# EAGLE design GPS_radiologger_v21_L70_CMWX (EAGLE 9.6.2)
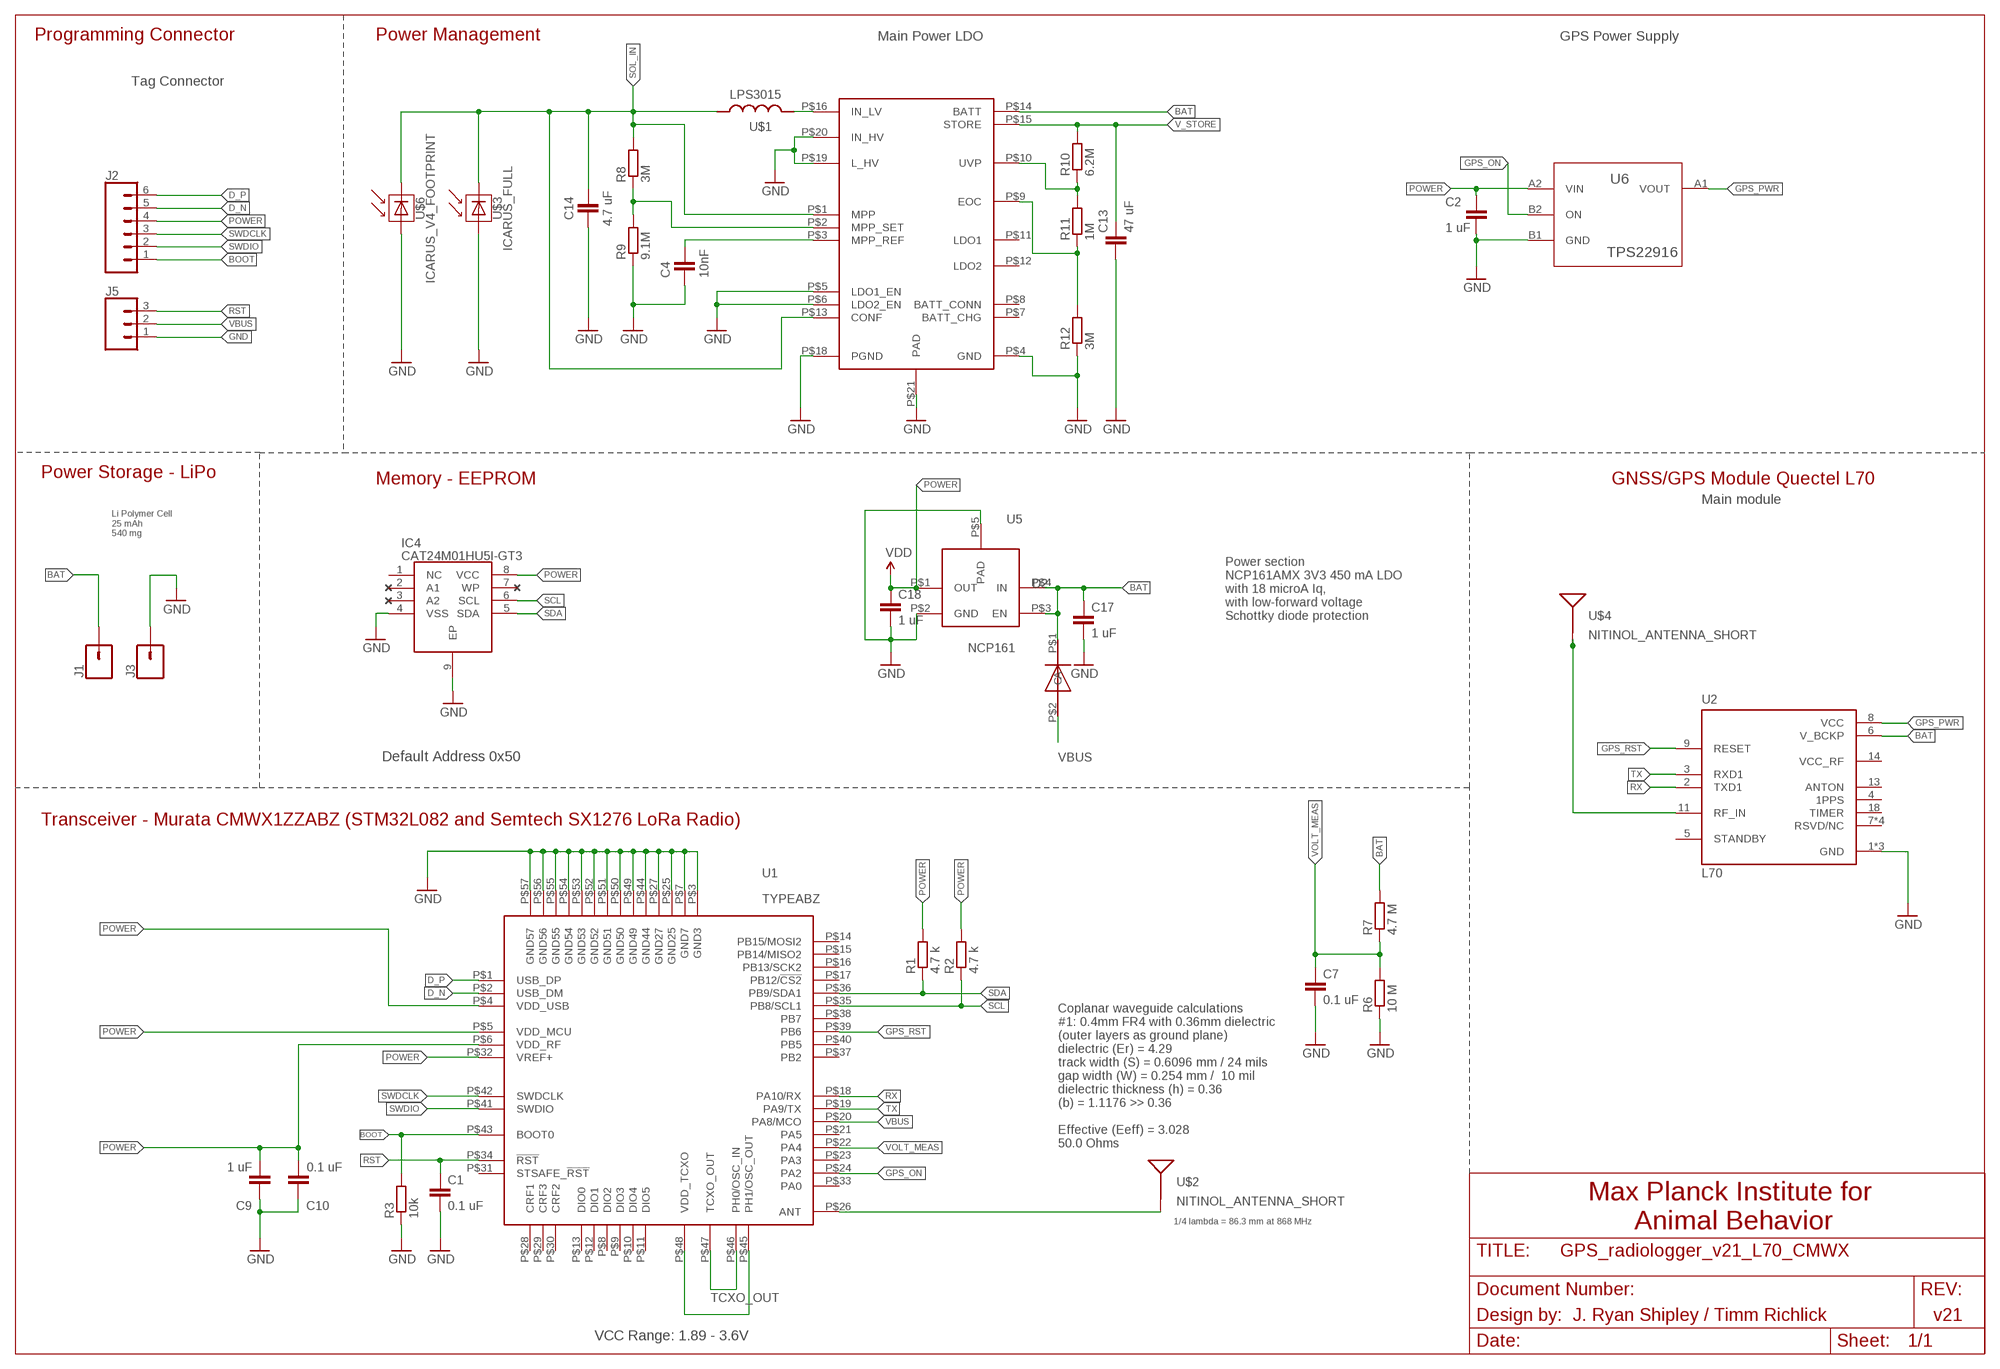
[diagram p0: schematic, sheet 1]

## Parts
C1  0.1 uF  C-EUC0201  [C0201]
C2  1 uF  C-EUC0201  [C0201]
C4  10nF  C-EUC0201  [C0201]
C7  0.1 uF  C-EUC0201  [C0201]
C9  1 uF  C-EUC0201  [C0201]
C10  0.1 uF  C-EUC0201  [C0201]
C13  47 uF  C-EUC0603  [C0603]
C14  4.7 uF  C-EUC0201  [C0201]
C17  1 uF  0402CAP.KW  [0402-CAP]
C18  1 uF  0402CAP.KW  [0402-CAP]
D2  CDSQR4148-HF  [CDSQR4148-HF]
IC4  CAT24M01HU5I-GT3  [SON50P300X200X55-9N]
J1  CONN_01PTH_NO_SILK_SMALL  [1X01_SMALL]
J2  CONN_061.27MM  [1X06_1.27MM]
J3  CONN_01PTH_NO_SILK_SMALL  [1X01_SMALL]
J5  CONN_031X03_1.27_NO_SILK  [1X03_1.27MM_NO_SILK]
R1  4.7 k  R-EU_R0201  [R0201]
R2  4.7 k  R-EU_R0201  [R0201]
R3  10k  R-EU_R0201  [R0201]
R6  10 M  R-EU_R0201  [R0201]
R7  4.7 M  R-EU_R0201  [R0201]
R8  3M  R-EU_R0201  [R0201]
R9  9.1M  R-EU_R0201  [R0201]
R10  6.2M  R-EU_R0201  [R0201]
R11  1M  R-EU_R0201  [R0201]
R12  3M  R-EU_R0201  [R0201]
U1  TYPEABZ  [TYPEABZ]
U2  L70  [XCVR_L70]
U4  SPV1050  [SPV1050]
U5  NCP161  [NCP161]
U6  TPS22916  [TPS22916]
U$1  LPS3015  [LPS_3015]
U$2  NITINOL_ANTENNA_SHORT  [ICARUS_NITINOL_ANTENNA_SHORT]
U$3  ICARUS_FULL  [ICARUS_FULL]
U$4  NITINOL_ANTENNA_SHORT  [ICARUS_NITINOL_ANTENNA_SHORT]
U$6  ICARUS_V4_FOOTPRINT  [ICARUS_FULL_FOOTPRINT]

## Nets
BAT [battery]: C17.1 D2.P$1(C) J1.P$1 R7.2 U2.6(V_BCKP) U4.P$14(BATT) U5.P$3(EN) U5.P$4(IN)
BOOT: J2.1 R3.2 U1.P$43(BOOT0)
D_N [diff_pair]: J2.5 U1.P$2(USB_DM)
D_P [diff_pair]: J2.6 U1.P$1(USB_DP)
GND: C1.2 C2.2 C4.2 C7.2 C9.1 C10.1 C13.2 C14.2 C17.2 C18.2 IC4.4(VSS) IC4.9(EP) J3.P$1 J5.1 R3.1 R6.1 R9.1 R12.1 U1.P$3(GND3) U1.P$7(GND7) U1.P$25(GND25) U1.P$27(GND27) U1.P$44(GND44) U1.P$49(GND49) U1.P$50(GND50) U1.P$51(GND51) U1.P$52(GND52) U1.P$53(GND53) U1.P$54(GND54) U1.P$55(GND55) U1.P$56(GND56) U1.P$57(GND57) U2.1(GND) U2.10(GND) U2.12(GND) U4.P$4(GND) U4.P$5(LDO1_EN) U4.P$6(LDO2_EN) U4.P$18(PGND) U4.P$19(L_HV) U4.P$20(IN_HV) U4.P$21(PAD) U5.P$2(GND) U5.P$5(PAD) U6.B1(GND) U$3.P$2(MINUS) U$6.P$3(MINUS)
GPS_ON: U1.P$24(PA2) U6.B2(ON)
GPS_PWR: U2.8(VCC) U6.A1(VOUT)
GPS_RST: U1.P$39(PB6) U2.9(RESET)
N$1: U1.P$45(PH1/OSC_OUT) U1.P$48(VDD_TCXO)
N$2 [antenna]: U2.11(RF_IN) U$4.1(SIGNAL) U$4.2(SIGNAL) U$4.3(SIGNAL)
N$4: U4.P$16(IN_LV) U$1.P$2
N$6: R8.1 R9.2 U4.P$2(MPP_SET)
N$8: R10.1 R11.2 U4.P$10(UVP)
N$9: R11.1 R12.2 U4.P$9(EOC)
N$11 [antenna]: U1.P$26(ANT) U$2.1(SIGNAL) U$2.2(SIGNAL) U$2.3(SIGNAL)
N$13: C4.1 U4.P$3(MPP_REF)
POWER [power]: C2.1 C9.2 C10.2 C18.1 IC4.8(VCC) J2.4 R1.2 R2.2 U1.P$4(VDD_USB) U1.P$5(VDD_MCU) U1.P$6(VDD_RF) U1.P$32(VREF+) U5.P$1(OUT) U6.A2(VIN) ; supply symbol labelled VDD
RST: C1.1 J5.3 U1.P$34(!RST)
RX: U1.P$18(PA10/RX) U2.2(TXD1)
SCL: IC4.6(SCL) R2.1 U1.P$35(PB8/SCL1)
SDA: IC4.5(SDA) R1.1 U1.P$36(PB9/SDA1)
SOL_IN [battery]: C14.1 R8.2 U4.P$1(MPP) U4.P$13(CONF) U$1.P$1 U$3.P$1(PLUS) U$6.P$1(PLUS)
SWDCLK: J2.3 U1.P$42(SWDCLK)
SWDIO: J2.2 U1.P$41(SWDIO)
TCXO_OUT: U1.P$46(PH0/OSC_IN) U1.P$47(TCXO_OUT)
TX: U1.P$19(PA9/TX) U2.3(RXD1)
V_STORE: C13.1 R10.2 U4.P$15(STORE)
VBUS: D2.P$2(A) J5.2 U1.P$20(PA8/MCO)
VOLT_MEAS: C7.1 R6.2 R7.1 U1.P$22(PA4)
Unconnected: IC4.1(NC) IC4.2(A1) IC4.3(A2) IC4.7(WP) U1.P$8(DIO2) U1.P$9(DIO3) U1.P$10(DIO4) U1.P$11(DIO5) U1.P$12(DIO1) U1.P$13(DIO0) U1.P$14(PB15/MOSI2) U1.P$15(PB14/MISO2) U1.P$16(PB13/SCK2) U1.P$17(PB12/!CS2) U1.P$21(PA5) U1.P$23(PA3) U1.P$28(CRF1) U1.P$29(CRF3) U1.P$30(CRF2) U1.P$31(STSAFE_!RST) U1.P$33(PA0) U1.P$37(PB2) U1.P$38(PB7) U1.P$40(PB5) U2.4(1PPS) U2.5(STANDBY) U2.7(RSVD/NC) U2.13(ANTON) U2.14(VCC_RF) U2.15(RSVD/NC) U2.16(RSVD/NC) U2.17(RSVD/NC) U2.18(TIMER) U4.P$7(BATT_CHG) U4.P$8(BATT_CONN) U4.P$11(LDO1) U4.P$12(LDO2)

## Notes on the sheet
- Programming Connector | Power Management | Main Power LDO | GPS Power Supply
- Tag Connector
- Power Storage - LiPo
- Memory - EEPROM | GNSS/GPS Module Quectel L70
- Main module
- Li Polymer Cell
  25 mAh
  540 mg
- Power section
  NCP161AMX 3V3 450 mA LDO
  with 18 microA Iq, 
  with low-forward voltage 
  Schottky diode protection
- Default Address 0x50
- Transceiver - Murata CMWX1ZZABZ (STM32L082 and Semtech SX1276 LoRa Radio)
- Coplanar waveguide calculations
  #1: 0.4mm FR4 with 0.36mm dielectric 
  (outer layers as ground plane)
  dielectric (Er) = 4.29
  track width (S) = 0.6096 mm / 24 mils
  gap width (W) = 0.254 mm /  10 mil
  dielectric thickness (h) = 0.36
  (b) = 1.1176 >> 0.36
  
  Effective (Eeff) = 3.028
  50.0 Ohms
- Max Planck Institute for 
  Animal Behavior
- 1/4 lambda = 86.3 mm at 868 MHz
- Design by: | J. Ryan Shipley / Timm Richlick | v21
- VCC Range: 1.89 - 3.6V

## Library data of the parts
C1 C2 C4 C7 C9 C10 C13 C14 = rcl:C-EU: CAPACITOR, European symbol; SPICEPREFIX: C
C17 C18 = SparkFun-Capacitors:0402CAP.KW
D2 = Kris:CDSQR4148-HF: ComChip's CDSQR4148-HF high speed 150 mA Io diode
IC4 = CAT24M01HU5I-GT3-CorrectedV2:CAT24M01HU5I-GT3: EEPROM 1MB I2C SERIAL EEPROM Source: Datasheet <http://www.onsemi.com/pub/Collateral/CAT24M01-D.PDF>; ALLIED_NUMBER: 70300250; ALLIED_PRICE-STOCK: http://www.alliedelec.com/on-semiconductor-cat24m01hu5i-gt3/70300250/; DESCRIPTION: EEPROM 1MB I2C SERIAL EEPROM; HEIGHT: 0.55mm; MANUFACTURER_NAME: ON Semiconductor; MANUFACTURER_PART_NUMBER: CAT24M01HU5I-GT3; MOUSER_PART_NUMBER: 863-CAT24M01HU5I-GT3; MOUSER_PRICE-STOCK: https://www.mouser.com/Search/Refine.aspx?Keyword=863-CAT24M01HU5I-GT3; RS_PART_NUMBER: 7814831P; RS_PRICE-STOCK: http://uk.rs-online.com/web/p/products/7814831P
J1 J3 = SparkFun-Connectors:CONN_01: Single connection point. Often used as Generic Header-pin footprint for 0.1 inch spaced/style header connections On any of the 0.1 inch spaced packages, you can populate with these: Break Away Headers - Straight <https://www.sparkfun.com/products/116> (PRT-00116) Break Away Male Headers - Right Angle <https://www.sparkfun.com/products/553> (PRT-00553) Female Headers <https://www.sparkfun.com/products/115> (PRT-00115) Break Away Headers - Machine Pin <https://www.sparkfun.com/products/117> (PRT-00117) Break Away Female Headers - Swiss Machine Pin <https://www.sparkfun.com/products/743> (PRT-00743) This device is also useful as a general connection point to wire up your design to another part of your project. Our various solder wires solder well into these plated through hole pads. Hook-Up Wire - Assortment (Stranded, 22 AWG) <https://www.sparkfun.com/products/11375> (PRT-11375) Hook-Up Wire - Assortment (Solid Core, 22 AWG) <https://www.sparkfun.com/products/11367> (PRT-11367) View the entire wire category on our website here <https://www.sparkfun.com/categories/141> Special notes: SMTSO-256-ET is a "flush mount" nut for a 4-40 screw. We mostly use this on specialty testbeds; it is a nice way to connect hardware to your PCB at an adjustable hieght. Also note, the SNAP packages are for using a snappable style connector. We sell a baggie of snaps and they are also used on two LilyPad designs: Snap Assortment - 30 pack (male and female) <https://www.sparkfun.com/products/11347> (DEV-11347) LilyPad Arduino SimpleSnap <https://www.sparkfun.com/products/10941> (DEV-10941) LilyPad SimpleSnap Protoboard <https://www.sparkfun.com/products/10940> (DEV-10940)
J2 = SparkFun-Connectors:CONN_06: Multi connection point. Often used as Generic Header-pin footprint for 0.1 inch spaced/style header connections On any of the 0.1 inch spaced packages, you can populate with these: Break Away Headers - Straight <https://www.sparkfun.com/products/116> (PRT-00116) Break Away Male Headers - Right Angle <https://www.sparkfun.com/products/553> (PRT-00553) Female Headers <https://www.sparkfun.com/products/115> (PRT-00115) Break Away Headers - Machine Pin <https://www.sparkfun.com/products/117> (PRT-00117) Break Away Female Headers - Swiss Machine Pin <https://www.sparkfun.com/products/743> (PRT-00743) Arduino Stackable Header - 6 Pin <https://www.sparkfun.com/products/9280> (PRT-09280) For SCREWTERMINALS and SPRING TERMINALS visit here: Screw Terimnals on SparkFun.com <https://www.sparkfun.com/search/results?term=Screw+Terminals> (5mm/3.5mm/2.54mm spacing) This device is also useful as a general connection point to wire up your design to another part of your project. Our various solder wires solder well into these plated through hole pads. Hook-Up Wire - Assortment (Stranded, 22 AWG) <https://www.sparkfun.com/products/11375> (PRT-11375) Hook-Up Wire - Assortment (Solid Core, 22 AWG) <https://www.sparkfun.com/products/11367> (PRT-11367) View the entire wire category on our website here <https://www.sparkfun.com/categories/141>
J5 = SparkFun-Connectors:CONN_03: Multi connection point. Often used as Generic Header-pin footprint for 0.1 inch spaced/style header connections On any of the 0.1 inch spaced packages, you can populate with these: Break Away Headers - Straight <https://www.sparkfun.com/products/116> (PRT-00116) Break Away Male Headers - Right Angle <https://www.sparkfun.com/products/553> (PRT-00553) Female Headers <https://www.sparkfun.com/products/115> (PRT-00115) Break Away Headers - Machine Pin <https://www.sparkfun.com/products/117> (PRT-00117) Break Away Female Headers - Swiss Machine Pin <https://www.sparkfun.com/products/743> (PRT-00743) Stackable Header - 3 Pin (Female, 0.1") <https://www.sparkfun.com/products/13875> (PRT-13875) For SCREWTERMINALS and SPRING TERMINALS visit here: Screw Terimnals on SparkFun.com <https://www.sparkfun.com/search/results?term=Screw+Terminals> (5mm/3.5mm/2.54mm spacing) This device is also useful as a general connection point to wire up your design to another part of your project. Our various solder wires solder well into these plated through hole pads. Hook-Up Wire - Assortment (Stranded, 22 AWG) <https://www.sparkfun.com/products/11375> (PRT-11375) Hook-Up Wire - Assortment (Solid Core, 22 AWG) <https://www.sparkfun.com/products/11367> (PRT-11367) View the entire wire category on our website here <https://www.sparkfun.com/categories/141> Special notes: Molex polarized connector foot print use with SKU : PRT-08232 with associated crimp pins and housings.
R1-R3 R6-R12 = rcl:R-EU_: RESISTOR, European symbol; SPICEPREFIX: R
U1 = Kris:TYPEABZ: CMWX1ZZABZ-078
U2 = L70:L70: GPS Module Check prices <https://pricing.snapeda.com/parts/L70/Quectel/view-part?ref=eda>; AVAILABILITY: Warning; DESCRIPTION: L70, an SMD type module, brings the high performance of MTK positioning engine to the industrial applications with compact profile, ultra low power consumption and fast positioning capability.; MF: Quectel; MP: L70; PACKAGE: 2920 Quectel; PRICE: None
U4 = STM-SPV1050_V2:SPV1050
U5 = Kris:NCP161: NCP161 3V3 LDO voltage regulator
U6 = TPS22916V2:TPS22916: Linear Regulator; AVAILABILITY: Unavailable; DESCRIPTION: Linear Voltage Regulator IC 1 Output 150mA 4-DSBGA (1x1); MF: Texas Instruments; MP: LP5900TL-3.0; PACKAGE: WFBGA-4 Texas Instruments; PRICE: None
U$1 = coilcraft_custom:LPS3015
U$2 U$4 = Antenna_mounts:NITINOL_ANTENNA_SHORT
U$3 = TrisolX_Solar_Cells:ICARUS_FULL
U$6 = TrisolX_Solar_Cells:ICARUS_V4_FOOTPRINT

## Net classes
1 power: width 0.152 mm
2 antenna: width 0.61 mm, clearance 0.254 mm
3 battery: width 0.152 mm
4 diff_pair: width 0.178 mm, clearance 0.152 mm

## Board
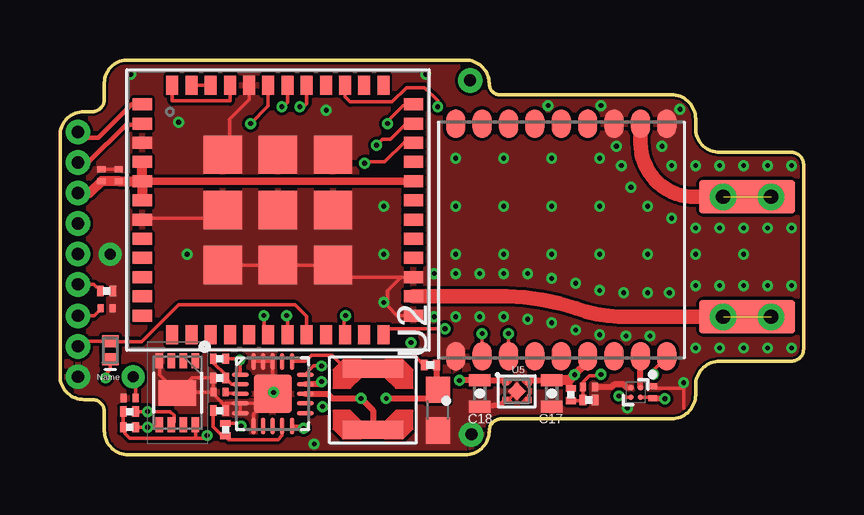
[diagram p1: board, top side]
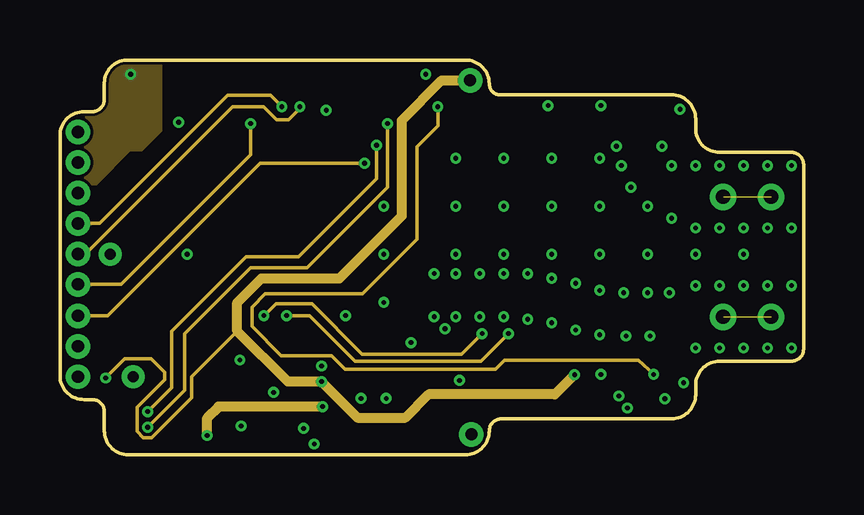
[diagram p2: board, inner layer Route2]
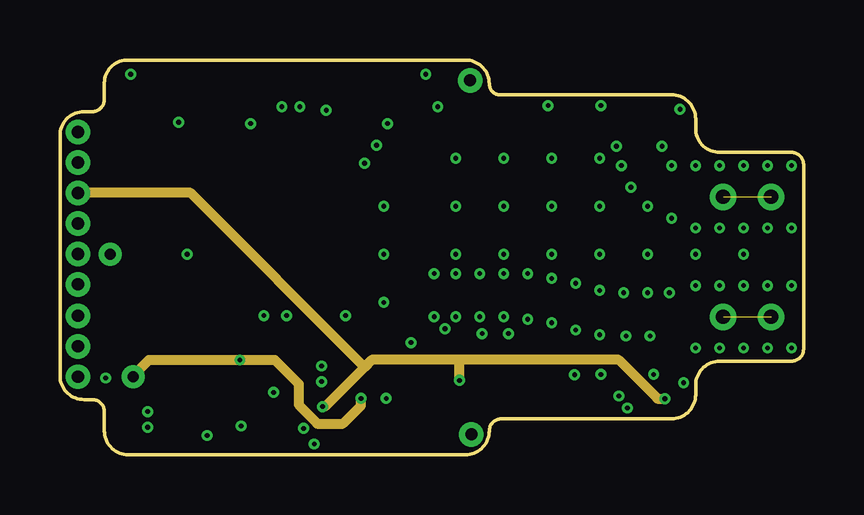
[diagram p3: board, inner layer Route15]
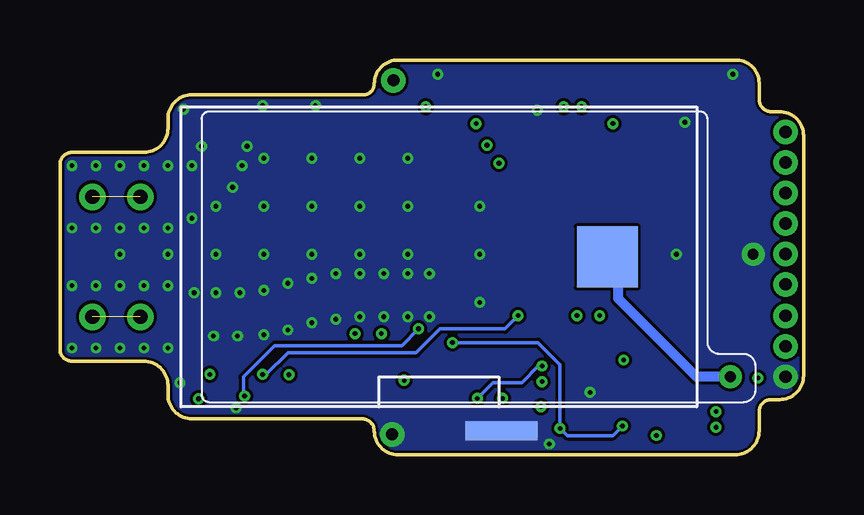
[diagram p4: board, bottom side, seen from below]

Size 31 x 16.45 mm. Coordinates in mm from the lower left corner, seen from the top.
Outline: 25.5,15 18.35,15 arc-90 17.9,15.45 arc90 16.9,16.45 2.85,16.45 arc90 1.85,15.5 1.85,14.8 arc-90 1.35,14.3 1,14.3 arc90 0,13.3 0,3.3 arc90 1,2.3 1.35,2.3 arc-90 1.85,1.8 1.85,1 arc90 2.85,0 16.9,0 arc90 17.9,1 arc-90 18.4,1.5 25.5,1.5 arc90 26.5,2.5 26.5,2.9 arc-90 27.5,3.9 30.5,3.9 arc90 31,4.4 31,12.1 arc90 30.5,12.6 27.5,12.6 arc-90 26.5,13.6 26.5,14 arc90 25.5,15
Copper layers (1*2+15*16): Top 0.035mm / dielectric 0.08mm / Route2 0.035mm / dielectric 0.08mm / Route15 0.035mm / dielectric 0.11mm / Bottom 0.035mm
Design rules "default *": minimum track width 5mil, minimum drill 0.2mm, track to track 5mil, track to pad 5mil, pad to pad 5mil, via to via 5mil, smd to smd 5mil, copper to edge 4mil, drill to drill 4mil, minimum pad ring 10mil, minimum via ring 5mil, stop-mask expansion 0mil, vias tented up to drill 20mil, thermal gap 0mil

### Footprints (pad centres in the part's own frame; a part is rotated, then mirrored left to right if it is on the bottom)
C0201 = smd 0.25 x 0.35: 1 -0.25,0; 2 0.25,0
C0603 = smd 1.1 x 1: 1 -0.85,0; 2 0.85,0
0402-CAP = smd 0.5 x 0.9: 1 -0.55,0; 2 0.55,0
CDSQR4148-HF = smd 0.7 x 0.5: P$1 0,0.375; P$2 0,-0.375
SON50P300X200X55-9N = smd 0.63 x 0.32: 1 -1.33,0.75; 2 -1.33,0.25; 3 -1.33,-0.25; 4 -1.33,-0.75; 5 1.33,-0.75; 6 1.33,-0.25; 7 1.33,0.25; 8 1.33,0.75 | smd 1.06 x 1.56: 9 0,0
1X01_SMALL = drill 0.508: P$1 0,0
1X06_1.27MM = drill 0.508 pad 1: 1 0,0; 2 1.27,0; 3 2.54,0; 4 3.81,0; 5 5.08,0; 6 6.35,0
1X03_1.27MM_NO_SILK = drill 0.508 pad 1: 1 0,0; 2 1.27,0; 3 2.54,0
R0201 = smd 0.28 x 0.43: 1 -0.255,0; 2 0.255,0
TYPEABZ = smd 0.8 x 0.5: P$1 -5.65,4.4; P$2 -5.65,3.6; P$3 -5.65,2.8; P$4 -5.65,2; P$5 -5.65,1.2; P$6 -5.65,0.4; P$7 -5.65,-0.4; P$8 -5.65,-1.2; P$9 -5.65,-2; P$10 -5.65,-2.8; P$11 -5.65,-3.6; P$12 -5.65,-4.4; P$25 5.65,-4.4; P$26 5.65,-3.6; P$27 5.65,-2.8; P$28 5.65,-2; P$29 5.65,-1.2; P$30 5.65,-0.4; P$31 5.65,0.4; P$32 5.65,1.2; P$33 5.65,2; P$34 5.65,2.8; P$35 5.65,3.6; P$36 5.65,4.4 | smd 0.5 x 0.8: P$13 -4.4,-5.2; P$14 -3.6,-5.2; P$15 -2.8,-5.2; P$16 -2,-5.2; P$17 -1.2,-5.2; P$18 -0.4,-5.2; P$19 0.4,-5.2; P$20 1.2,-5.2; P$21 2,-5.2; P$22 2.8,-5.2; P$23 3.6,-5.2; P$24 4.4,-5.2; P$37 4.4,5.2; P$38 3.6,5.2; P$39 2.8,5.2; P$40 2,5.2; P$41 1.2,5.2; P$42 0.4,5.2; P$43 -0.4,5.2; P$44 -1.2,5.2; P$45 -2,5.2; P$46 -2.8,5.2; P$47 -3.6,5.2; P$48 -4.4,5.2 | smd 1.6 x 1.6: P$49 -2.3,2.3; P$50 0,2.3; P$51 2.3,2.3; P$52 -2.3,0; P$53 0,0; P$54 2.3,0; P$55 -2.3,-2.3; P$56 0,-2.3; P$57 2.3,-2.3
XCVR_L70 = smd 1.2 x 0.8: 1 -4.85,4.4; 2 -4.85,3.3; 3 -4.85,2.2; 4 -4.85,1.1; 5 -4.85,0; 6 -4.85,-1.1; 7 -4.85,-2.2; 8 -4.85,-3.3; 9 -4.85,-4.4; 10 4.85,-4.4; 11 4.85,-3.3; 12 4.85,-2.2; 13 4.85,-1.1; 14 4.85,0; 15 4.85,1.1; 16 4.85,2.2; 17 4.85,3.3; 18 4.85,4.4
SPV1050 = smd 0.7 x 0.18: P$1 -1.35,0.8; P$2 -1.35,0.4; P$3 -1.35,0; P$4 -1.35,-0.4; P$5 -1.35,-0.8; P$11 1.35,-0.8; P$12 1.35,-0.4; P$13 1.35,0; P$14 1.35,0.4; P$15 1.35,0.8 | smd 0.18 x 0.7: P$6 -0.8,-1.35; P$7 -0.4,-1.35; P$8 0,-1.35; P$9 0.4,-1.35; P$10 0.8,-1.35; P$16 0.8,1.35; P$17 0.4,1.35; P$18 0,1.35; P$19 -0.4,1.35; P$20 -0.8,1.35 | smd 1.6 x 1.6: P$21 0,0
NCP161 = smd 0.24 x 0.24: P$1 -0.37,-0.48; P$2 0.37,-0.48; P$3 0.37,0.48; P$4 -0.37,0.48 | smd 0.52 x 0.52 rotated 45: P$5 0,0
TPS22916 = smd 0.23 x 0.23: A1 -0.254,0.254; A2 0.144,0.254; B1 -0.254,-0.144; B2 0.144,-0.144
LPS_3015 = smd 0.75 x 2.54: P$1 -1.3,0; P$2 1.25,0
ICARUS_NITINOL_ANTENNA_SHORT = smd 4 x 1.4: 1 0,0 | drill 0.6: 2 -1,0; 3 1,0
ICARUS_FULL = smd 2.54 x 2.54: P$1 0,-7.02 | smd 0.8 x 3: P$2 -7.25,-2.61
ICARUS_FULL_FOOTPRINT = drill 0.45: P$1 5,11.5; P$3 -0.1,12.45

### Placement (x,y rotation side)
C1  1.94,6.1 0 top
C2  24.7,2.6 90 top
C4  6.65,2.61 180 top
C7  22.05,2.82 0 top
C9  2.45,11.66 270 top
C10  1.73,11.66 270 top
C13  15.75,1.86 270 top
C14  2.9,2.36 180 top
C17  20.5,2.55 270 top
C18  17.5,2.55 270 top
D2  2.1,4.35 180 top
IC4  4.9,2.58 270 top
J1  17.1,15.6 0 top
J2  0.75,7.1 90 top
J3  17.15,0.85 0 top
J5  0.75,3.25 90 top
R1  2.9,1.15 180 top
R2  2.9,1.8 180 top
R3  1.94,6.83 180 top
R6  22.05,2.28 180 top
R7  21.3,2.5 90 top
R8  6.65,4 0 top
R9  6.65,3.2 0 top
R10  15.44,3.74 0 top
R11  6.9,1.05 90 top
R12  6.65,1.84 180 top
U1  9.09,10.2 0 top
U2  20.9,8.95 90 top
U4  8.87,2.54 0 top
U5  19.05,2.65 270 top
U6  23.95,2.55 270 top
U$1  13.05,2.33 90 top
U$2  28.65,5.75 0 top
U$3  15.2,8.25 90 bottom
U$4  28.65,10.75 180 top
U$6  14.55,8.25 270 bottom

### Tracks (layer width: path | path; a pad name or v marks a point on that pad's centre or on a via)
BAT  (via drill 0.2)
  Top 0.152: v10.9,3.05 10.79,2.94 | U5.P$4 19.53,2.82 19.62,2.73 19.62,2.57 19.53,2.47 U5.P$3 | R7.2 21.3,3.19 v21.46,3.34 | D2.P$1 2.1,3.55 1.9,3.35 v1.9,3.2
  Top 0.254: 10.79,2.94 U4.P$14 | U5.P$4 19.61,3.1 C17.1
  Top 0.305: U2.6 22,3.88 v21.46,3.34
  Top 0.406: v21.46,3.34 21.22,3.1 C17.1
  Route2 0.152: 7.39,5.16 5.48,3.24 5.48,2.37 3.83,0.72 3.47,0.72 3.22,0.97 3.22,1.98 4.37,3.13 4.37,3.43 3.8,4 2.7,4 v1.9,3.2
  Route2 0.406: v21.46,3.34 20.64,2.52 15.37,2.52 14.4,1.55 12.4,1.55 v10.9,3.05 9.5,3.05 7.39,5.16 7.39,6.34 8.4,7.35 11.65,7.35 14.25,9.95 14.25,13.94 15.91,15.6 J1.P$1
BOOT  (via drill 0.2)
  Top 0.152: U1.P$43 8.69,14.54 v7.95,13.8 | J2.1 1.42,7.1 R3.2
  Route2 0.152: v7.95,13.8 7.95,12.5 2.55,7.1 J2.1
D_N
  Top 0.178: 3.39,13.75 2.75,13.75 1.18,12.18
  Top 0.203: U1.P$2 3.39,13.75 | 1.18,12.18 J2.5
D_P
  Top 0.178: U1.P$1 3,14.6 1.6,13.2 1,13.2
  Top 0.203: 1,13.2 J2.6
GND  (via drill 0.2)
  Top 0.15: R12.1 6.9,2.15 U4.P$4 | U1.P$25 14.05,5.8 13.65,6.2 13.65,6.83 14.22,7.4 U1.P$27
  Top 0.152: C4.2 R9.1 5.5,3.2 IC4.9 | U4.P$5 U4.P$4 8.5,2.15 | 8.5,2.15 8.87,2.52 U4.P$21 8.87,3.8 | 8.87,3.8 U4.P$18 | U1.P$55 U1.P$56 U1.P$57 11.39,7.71 11.7,7.4 U1.P$27 | U1.P$7 3.48,9.85 6.47,9.85 6.62,10 6.62,10.04 U1.P$52 | U4.P$20 U4.P$19 8.78,3.89 8.87,3.8 | C9.1 C10.1 | U1.P$44 7.89,14.79 7.07,13.98 7.07,12.78 U1.P$49 | C4.2 6.4,2.52 6.9,2.02 | C4.2 4.92,2.61 IC4.9 | U4.P$6 8.07,1.72 8.5,2.15 | U5.P$5 18.68,2.28 U5.P$2 | C2.2 24.87,2.85 24.87,2.77 26,2.77 26,1.95 | IC4.4 4.15,3.33 IC4.9
  Top 0.254: U5.P$2 18.35,2.06 C18.2 | U6.B1 23.63,2.8 23.5,2.93 23.11,2.93 23,2.82 C7.2
  other vias: 24.5,8.35 16.5,12.35 18.5,12.35 20.5,12.35 22.5,12.35 22.5,10.35 20.5,10.35 18.5,10.35 16.5,10.35 16.5,8.35 18.5,8.35 20.5,8.35 22.5,8.35 26.5,8.35 28.5,8.35 13.5,8.35 13.5,10.35 13.5,6.35 16.5,7.55 18.5,7.55 20.5,7.35 22.5,6.85 24.5,6.75 20.5,5.5 18.5,5.75 16.5,5.75 22.5,5 26.5,7.05 28.5,7.05 28.5,4.45 26.5,4.45 28.5,9.45 26.5,9.45 23.5,6.75 25.4,6.75 21.5,7.15 19.5,7.55 17.5,7.55 19.5,5.65 21.5,5.2 17.5,5.75 23.6,4.95 24.6,4.95 15.6,7.55 15.6,5.75 27.5,7.05 27.5,4.45 29.5,4.45 29.5,7.05 29.5,9.45 27.5,9.45 27.5,12.05 28.5,12.05 29.5,12.05 30.5,9.45 30.5,7.05 30.5,12.05 30.5,4.45 24.5,10.35 23.4,12.05 23.8,11.15 25.5,9.85 26.5,12.05 25.5,12.05 25.1,12.85 23.2,12.85 11.1,14.35 4.95,13.85 2.95,15.85 15.25,15.85 20.35,14.55 22.55,14.55 25.85,14.4 26,3 23.65,1.95 5.3,8.35 10.6,0.45 8.9,2.6
  pour Top: -0.71,19.28 32.46,19.28 32.46,-1.4 -0.71,-1.4
  pour Bottom: -0.65,19.55 33.2,19.55 33.2,-1.85 -0.65,-1.85
  pour Route2: 4.2,17.05 4.2,13.5 3.4,12.7 2.9,12.7 1.5,11.3 -0.05,11.3 -0.35,11.6 -0.35,16.3 0.35,17 0.4,17.05
GPS_ON  (via drill 0.2)
  Top 0.152: U1.P$24 13.74,5.25 v16.05,5.25 | v23.3,2.45 23.3,2.41 U6.B2
  Bottom 0.152: v16.05,5.25 16.75,4.55 22.05,4.55 23.35,3.25 23.35,2.5 v23.3,2.45
GPS_PWR
  Top 0.254: U6.A1 U2.8
GPS_RST  (via drill 0.2)
  Top 0.152: v15.75,14.5 15.75,14.75 15.2,15.3 14.45,15.3 13.85,14.7 12.1,14.7 11.89,14.91 U1.P$39 | U2.9 24.75,3.55 v24.75,3.35
  Route2 0.152: v15.75,14.5 15.75,13.7 14.88,12.83 14.88,8.97 12.61,6.7 8.55,6.7 8,6.15 8,5.35 9.22,4.13 11.33,4.13 11.89,3.57 18.17,3.57 18.53,3.93 24.12,3.93 v24.75,3.35
N$1
  Top 0.152: U1.P$48 4.69,14.75 7.09,14.75 U1.P$45
N$2  (2 unrouted)
  Top 0.61: 24.2,13.65 U2.11 24.2,13 arc86 26.3,10.75 U$4.1
N$4
  Top 0.152: U$1.P$2 11.91,3.58 11.35,4.15 10.48,4.15 10.22,3.89 U4.P$16
N$6
  Top 0.152: U4.P$2 7.17,2.94 R9.2 6.9,3.33 6.39,3.84 R8.1
N$8  (via drill 0.2)
  Top 0.152: R10.1 14.64,4.29 v14.64,4.68 | R11.2 7.44,1.3 v7.55,1.2 | U4.P$10 10.06,1.19 v10.15,1.1
  Bottom 0.152: v7.55,1.2 7.95,0.8 9.85,0.8 v10.15,1.1 10.15,3.76 11.07,4.68 v14.64,4.68
N$9
  Top 0.152: U4.P$9 9.27,0.82 9.09,0.64 7.03,0.64 6.88,0.78 R11.1 6.77,0.8 6.39,1.17 R12.2
N$11  (2 unrouted)
  Top 0.61: U$2.1 23.3,5.75 arc-15 21.5,6.1 arc17 18.64,6.6 U1.P$26
N$13
  Top 0.152: U4.P$3 7.5,2.56 6.95,2.56 C4.1
POWER  (via drill 0.2)
  Top 0.152: IC4.8 5.65,0.7 | R2.2 R1.2 2.7,1.09 2.7,0.9 2.9,0.7 5.65,0.7 | v6.14,0.81 6.14,0.76 6.08,0.7 5.65,0.7 | U6.A2 24.64,2.41 C2.1
  Top 0.254: U5.P$1 18.49,3.1 C18.1 v16.65,3.1 | v25.22,2.34 C2.1
  Top 0.305: U1.P$5 14.68,11.4 14.71,11.37
  Top 0.406: 14.71,11.37 U1.P$32 | C9.2 C10.2 1.23,10.91 J2.4 | C9.2 | C9.2 U1.P$5 | U1.P$5 U1.P$4 | U1.P$5 U1.P$6
  Route2 0.406: v10.95,2.01 6.61,2.01 6.14,1.54 v6.14,0.81
  Route15 0.406: 12.7,3.65 12.99,3.95 16.65,3.95 | 16.65,3.95 23.3,3.95 24.9,2.35 24.91,2.34 v25.22,2.34 | 12.7,3.65 11.05,2.01 v10.95,2.01 | J2.4 5.44,10.91 12.7,3.65 | v16.65,3.1 16.65,3.95
RST  (via drill 0.2)
  Top 0.152: U1.P$34 14.34,13 13.54,12.2 12.75,12.2 v12.7,12.15 | C1.1 1.69,6.05 1.42,5.79 J5.3
  Route2 0.152: v12.7,12.15 8.35,12.15 1.99,5.79 J5.3
RX  (via drill 0.2)
  Top 0.152: U1.P$18 8.5,5.19 v8.5,5.8 | U2.2 v17.6,5.05
  Route2 0.152: v8.5,5.8 9,6.3 10.5,6.3 12.6,4.2 16.75,4.2 v17.6,5.05
SCL  (via drill 0.2)
  Top 0.152: U1.P$35 14.44,13.8 13.79,13.15 13.45,13.15 v13.2,12.9 | R2.1 v3.65,1.8 4.6,1.8 4.75,1.65 4.75,1.35 IC4.6
  Route2 0.152: v13.2,12.9 13.2,11.5 9.95,8.25 7.75,8.25 4.65,5.15 4.65,2.8 v3.65,1.8
SDA  (via drill 0.2)
  Top 0.152: U1.P$36 14.69,14.55 14.3,14.55 13.65,13.9 v13.65,13.8 | IC4.5 4.04,1.15 v3.65,1.15 R1.1
  Route2 0.152: v13.65,13.8 13.65,11.15 10.3,7.8 7.95,7.8 5.2,5.05 5.2,2.7 v3.65,1.15
SOL_IN  (via drill 0.2)
  Top 0.152: U4.P$1 7.5,3.36 v7.5,3.95 7.45,4 R8.2 | U$6.P$1 3.15,3.15 C14.1
  Top 0.254: U$1.P$1 13.05,1.85 v12.55,2.35 11.35,2.35 11.16,2.54 U4.P$13
  Route15 0.406: U$6.P$1 3.05,3.29 3.71,3.95 v7.5,3.95 8.95,3.95 9.95,2.95 9.95,2.09 10.71,1.33 10.71,1.31 10.72,1.3 11.8,1.3 12.55,2.05 v12.55,2.35
  Bottom 0.406: U$6.P$1 4.46,3.25 7.73,6.52 7.73,7.8 U$3.P$1
SWDCLK  (via drill 0.2)
  Top 0.152: U1.P$42 9.49,14.69 9.3,14.5 v9.25,14.5
  Route2 0.152: v9.25,14.5 8.77,14.98 6.99,14.98 1.65,9.64 J2.3
SWDIO  (via drill 0.2)
  Top 0.152: U1.P$41 10.29,14.64 10.1,14.45 10.05,14.45 v10,14.5
  Route2 0.152: v10,14.5 10,14.44 9.53,13.97 9.02,13.97 8.49,14.5 7.2,14.5 1.07,8.37 J2.2
TCXO_OUT
  Top 0.152: U1.P$46 U1.P$47
TX  (via drill 0.2)
  Top 0.152: U2.3 v18.7,5.05 | v9.45,5.8 9.49,5.76 U1.P$19
  Route2 0.152: v9.45,5.8 10.4,5.8 12.3,3.9 17.55,3.9 v18.7,5.05
V_STORE  (via drill 0.2)
  Top 0.152: U4.P$15 10.58,3.7 v10.9,3.7
  Top 0.254: v13.6,2.35 15.39,2.35 C13.1 15.7,2.76 R10.2
  Bottom 0.152: v13.6,2.35 12.95,3 11.75,3 11.05,3.7 v10.9,3.7
VBUS
  Top 0.152: U1.P$20 10.29,5.76 9.8,6.25 4.95,6.25 3.4,4.7 2.12,4.7 D2.P$2 0.95,4.72 J5.2
VOLT_MEAS  (via drill 0.2)
  Top 0.152: U1.P$22 11.84,4.96 11.84,5.74 v11.9,5.8 | R7.1 21.8,2.25 R6.2 C7.1 21.8,3.03 22.07,3.3 22.5,3.3 v22.55,3.35
  Bottom 0.152: v11.9,5.8 12.45,5.25 15.15,5.25 16.15,4.25 21.5,4.25 22.4,3.35 v22.55,3.35

### Text on the board
tValues: + | -